# Altium schematic sheet Quarter to Full Bridge Strain Gauge Amplifier.SchDoc
size A4
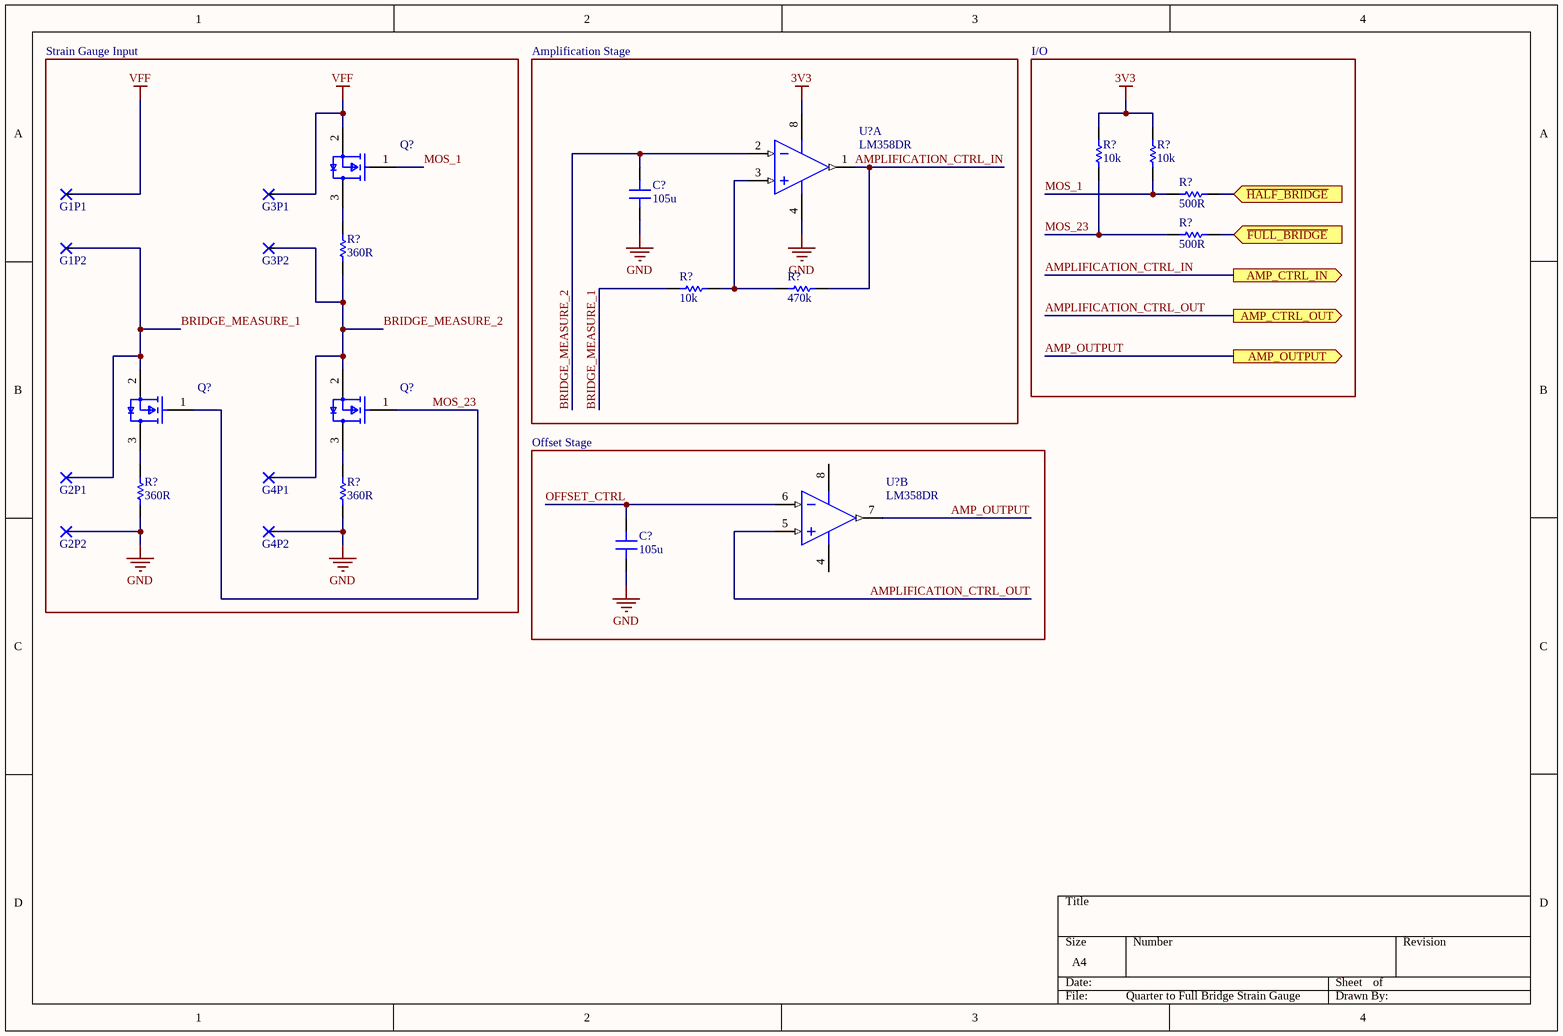
[diagram p0: Quarter to Full Bridge Strain Gauge Amplifier.SchDoc]

## Parts
(Parts that share a designator on the sheet are numbered #1, #2 ... from top to bottom, then left to right.)
C?#1  105u  [0805]
C?#2  105u  [0805]
G1P1  Rectangular  [2.5x5mm]  (value not drawn)
G1P2  Rectangular  [2.5x5mm]  (value not drawn)
G2P1  Rectangular  [2.5x5mm]  (value not drawn)
G2P2  Rectangular  [2.5x5mm]  (value not drawn)
G3P1  Rectangular  [2.5x5mm]  (value not drawn)
G3P2  Rectangular  [2.5x5mm]  (value not drawn)
G4P1  Rectangular  [2.5x5mm]  (value not drawn)
G4P2  Rectangular  [2.5x5mm]  (value not drawn)
Q?#1  (no value)  [FP-S-03946-MFG]
Q?#2  (no value)  [FP-S-03946-MFG]
Q?#3  (no value)  [FP-S-03946-MFG]
R?#1  10k  [0805]
R?#2  10k  [0805]
R?#3  500R  [0805]
R?#4  500R  [0805]
R?#5  360R  [0805]
R?#6  10k  [0805]
R?#7  470k  [0805]
R?#8  360R  [0805]
R?#9  360R  [0805]
U?#1  LM358DR  [D0008A_L]  (part A of 2)
U?#2  LM358DR  [D0008A_L]  (part B of 2)

## Blocks framed on the sheet
Strain Gauge Input: G1P1 G1P2 G2P1 G2P2 G3P1 G3P2 G4P1 G4P2 Q?#1-Q?#3 R?#5 R?#8 R?#9
Amplification Stage: C?#1 R?#6 R?#7 U?#1
I/O: R?#1-R?#4
Offset Stage: C?#2 U?#2

## Ports
AMP_CTRL_IN (out), AMP_CTRL_OUT (out), AMP_OUTPUT (out), ~{FULL_BRIDGE} (in), ~{HALF_BRIDGE} (in)

## Nets
3V3: R?#1.2 R?#2.2 U?#1.8(VCC)
GND: C?#1.1 C?#2.1 G2P2.1 G4P2.1 R?#8.2 R?#9.2 U?#1.4(GND)
VFF: G1P1.1 G3P1.1 Q?#1.2(S)
AMP_OUTPUT: U?#2.7(2OUT) ; port AMP_OUTPUT
AMPLIFICATION_CTRL_IN: R?#7.2 U?#1.1(1OUT) ; port AMP_CTRL_IN
AMPLIFICATION_CTRL_OUT: U?#2.5(2IN+) ; port AMP_CTRL_OUT
BRIDGE_MEASURE_1: G1P2.1 G2P1.1 Q?#2.2(S) R?#6.1
BRIDGE_MEASURE_2: C?#1.2 G3P2.1 G4P1.1 Q?#3.2(S) R?#5.2 U?#1.2(1IN-)
~{FULL_BRIDGE}: R?#4.2 ; port ~{FULL_BRIDGE}
~{HALF_BRIDGE}: R?#3.2 ; port ~{HALF_BRIDGE}
MOS_1: Q?#1.1(G) R?#2.1 R?#3.1
MOS_23: Q?#2.1(G) Q?#3.1(G) R?#1.1 R?#4.1
OFFSET_CTRL: C?#2.2 U?#2.6(2IN-)
NetQ?#1_3: Q?#1.3(D) R?#5.1
NetQ?#2_3: Q?#2.3(D) R?#8.1
NetQ?#3_3: Q?#3.3(D) R?#9.1
NetR?#6_2: R?#6.2 R?#7.1 U?#1.3(1IN+)

Not connected (* = marked no-connect by the designer): U?#2 4(GND) 8(VCC)

## Library data of the parts
C?#1 C?#2 = Capacitor - Ceramic: Value: 105u
Q?#1-Q?#3 = CMP-02550-000018-1: MOSFET N-CH 8V 6A SOT-23; Manufacturer Part Number: SI2342DS-T1-GE3; Manufacturer: Vishay; Number Of N Channels: 1; Pulse Drain Current: 30A; Reverse Recovery Charge: 17nC; Depletion Mode: False; Reverse Recovery Time: 40ns; Max Junction Temp: +150°C; Power Dissipation: 1.3W; Transconductance: 75S; Threshold Vgs Min: 0.35V; Turn Off Delay Time: 65ns; Rthja Max: 75°C/W; Input Capacitace At Vds: 1070pF @ 4V; Gate Charge At Vgs: 10.5nC @ 4.5V; Gate To Source Voltage: 5V; Turn On Delay Time: 6ns; Drain To Source Resistance: 0.014Ω; Typ Forward Diode Voltage: 0.82V; Standoff Height: 0.01mm; Max Forward Diode Voltage: 1.2V; Threshold Vgs Max: 0.8V; Max Power Dissipation: 2.5W; Gate to Source Voltage (Vgs): 4.5V; Polarity: N-CHANNEL; Rise Time: 14ns; Fall Time: 25ns; Rds On Max: 17mR; Threshold Voltage: 800mV; Input Capacitance: 1.07nF; Continuous Drain Current: 6A; Device Class L1: Discrete Semiconductors; Mouser Description: MOSFET 8V 6A 2.5; Category: Trans; Digikey Description: MOSFET N-CH 8V 6A SOT-23; Device Class L2: Transistors; Octopart: https://octopart.com/si2342ds-t1-ge3-vishay-45050957; ComponentLink2URL: https://www.vishay.com/docs/63302/si2342ds.pdf; RoHS: TRUE; Drain To Source Breakdown Voltage: 8V; Height: 1.12mm; Lead Free: Yes; Temperature Range Low: -55°C; Package: S-03946; Device Class L3: MOSFETs; Temperature Range High: +150°C; Ipc Land Pattern Name: SOT95P237X100-3; Drain To Source Voltage: 8V; Temperature: -55°C to +150°C; ComponentLink2Description: Datasheet; Number Of Channels: 1; Automotive: No; Supplier 1: LCSC; Supplier Part Number 1: C142553; Stock 1: 1853; Pricing 1: 1=0.54970, 10=0.40750, 30=0.38390, 100=0.35780, 500=0.34590, 1000=0.33880, 1=0.53450, 10=0.39620, 30=0.37330, 100=0.34780, 500=0.33630, 1000=0.32940, 1=2.70270, 10=2.00380, 30=1.88750, 100=1.75890, 500=1.70080, 1000=1.66590, 1=2.58390, 10=1.91570, 30=1.80450, 100=1.68160, 500=1.62600, 1000=1.59270, 1=0.34740, 10=0.25750, 30=0.24260, 100=0.22610, 500=0.21860, 1000=0.21410, 1=0.30590, 10=0.22680, 30=0.21370, 100=0.19910, 500=0.19250, 1000=0.18860, 1=3.24330, 10=2.40460, 30=2.26500, 100=2.11080, 500=2.04100, 1000=1.99910, 1=43.91150, 10=32.55580, 30=30.66670, 100=28.57820, 500=27.63360, 1000=27.06690, 1=1.69290, 10=1.25510, 30=1.18230, 100=1.10170, 500=1.06530, 1000=1.04350, 1=31.86130, 10=23.62180, 30=22.25110, 100=20.73570, 500=20.05040, 1000=19.63920, 1=3.51200, 10=2.60380, 30=2.45270, 100=2.28560, 500=2.21010, 1000=2.16480, 1=0.55710, 10=0.41300, 30=0.38900, 100=0.36250, 500=0.35060, 1000=0.34340, 1=0.41840, 10=0.31020, 30=0.29220, 100=0.27230, 500=0.26330, 1000=0.25790 (AUD); Mount: Surface Mount; Case/Package: SOT-23-3; Number of Pins: 3; Weight: 0.000282oz; Contact Plating: Tin,Matte; Min Operating Temperature: -55°C; Max Operating Temperature: 150°C; Packaging: Cut Tape; Package Quantity: 3000; Drain to Source Voltage (Vdss): 8V; Continuous Drain Current (ID): 6A; Series: SI2; Turn-Off Delay Time: 65ns; Turn-On Delay Time: 6ns; Number of Elements: 1; Radiation Hardening: No; RoHS Compliant: Yes; REACH SVHC: No SVHC; ComponentLink1URL: https://datasheet.ciiva.com/29746/si2342ds-29746581.pdf?src-supplier=Digi-Key; ComponentLink1Description: https://datasheet.ciiva.com/29746/si2342ds-29746581.pdf?src-supplier=Digi-Key; ComponentLink3URL: https://datasheet.ciiva.com/14905/si2342ds-14905257.pdf?src-supplier=Arrow+Electronics; ComponentLink3Description: https://datasheet.ciiva.com/14905/si2342ds-14905257.pdf?src-supplier=Arrow+Electronics; ComponentLink4URL: https://datasheet.ciiva.com/30021/si2342ds-30021814.pdf?src-supplier=Avnet; ComponentLink4Description: https://datasheet.ciiva.com/30021/si2342ds-30021814.pdf?src-supplier=Avnet; Supplier 2: Digi-Key; Supplier Part Number 2: SI2342DS-T1-GE3CT-ND; Stock 2: 22419; Pricing 2: 1=0.51000, 10=0.43600, 25=0.40800, 100=0.30320, 500=0.23670, 1000=0.19239 (USD)
R?#1-R?#9 = Resistor
  R?#1 R?#2 R?#6: Value: 10k
  R?#3 R?#4: Value: 500R
  R?#5 R?#8 R?#9: Value: 360R
  R?#7: Value: 470k
U?#1 U?#2 = CMP-1685-00009-1: Dual Operational Amplifier, 3 to 32 V, 0 to 70 degC, 8-Pin SOIC (D), Green (RoHS & no Sb/Br), Tape and Reel; Manufacturer: Texas Instruments; Gain Bandwidth Product: 700kHz; Common Mode Rejection Ratio: 65dB; Min Supply Voltage: 3V; Max Dual Supply Voltage: 16V; Voltage Gain: 100dB; Max Supply Voltage: 32V; Min Dual Supply Voltage: 1.5V; Number of Channels: 2; Nominal Supply Current: 1.2mA; Slew Rate: 0.3V/µs; Input Offset Voltage (Vos): 7mV; Input Bias Current: 250nA; Output Current: 30mA; Operating Supply Current: 1mA; Dual Supply Voltage: 9V; DatasheetVersion: SLOS068T, 04/2015; ComponentLink1URL: http://www.ti.com/; ComponentLink2URL: http://www.ti.com/lit/ds/symlink/lm358.pdf; ComponentLink3Description: Package Specification; Code_JEDEC: MS-012; PackageDescription: 8-Pin Small Outline Integrated Circuit, Body 4.9 x 3.9 mm, Pitch 1.27 mm; ComponentLink2Description: Datasheet; PackageVersion: 4040047-3/M, 06/2011; ComponentLink1Description: Manufacturer URL; ComponentLink3URL: http://www.ti.com/lit/ml/msoi002j/msoi002j.pdf; PackageReference: D0008A; Supplier 1: LCSC; Supplier Part Number 1: C5423; Manufacturer Part Number: LM358DR; RoHS: Yes; Category: Amplifiers - Op Amps, Buffer, Instrumentation; Stock 1: 7990; Pricing 1: 5=0.15780, 50=0.11970, 150=0.11270, 500=0.10580, 2500=0.10270, 5000=0.10110, 5=0.15420, 50=0.11700, 150=0.11020, 500=0.10340, 2500=0.10030, 5000=0.09880, 5=0.78630, 50=0.59640, 150=0.56190, 500=0.52730, 2500=0.51160, 5000=0.50380, 5=0.72970, 50=0.55350, 150=0.52140, 500=0.48930, 2500=0.47470, 5000=0.46750, 5=0.09810, 50=0.07440, 150=0.07010, 500=0.06580, 2500=0.06380, 5000=0.06280, 5=0.08900, 50=0.06750, 150=0.06360, 500=0.05970, 2500=0.05790, 5000=0.05700, 5=0.93420, 50=0.70860, 150=0.66750, 500=0.62640, 2500=0.60780, 5000=0.59850, 5=12.45670, 50=9.44850, 150=8.90060, 500=8.35270, 2500=8.10460, 5000=7.98060, 5=0.48680, 50=0.36920, 150=0.34780, 500=0.32640, 2500=0.31670, 5000=0.31180, 5=8.87080, 50=6.72860, 150=6.33840, 500=5.94830, 2500=5.77160, 5000=5.68320, 5=0.98590, 50=0.74780, 150=0.70440, 500=0.66110, 2500=0.64140, 5000=0.63160, 5=0.15970, 50=0.12110, 150=0.11410, 500=0.10710, 2500=0.10390, 5000=0.10230, 5=0.12050, 50=0.09140, 150=0.08610, 500=0.08080, 2500=0.07840, 5000=0.07720 (AUD); Mount: Surface Mount; Case/Package: SOIC; Number of Pins: 8; Contact Plating: Gold; Min Operating Temperature: 0°C; Max Operating Temperature: 70°C; Packaging: Tape and Reel; Number of Circuits: 2; Operating Supply Voltage: 16V; Package Quantity: 2500; Bandwidth: 700kHz; Output Current per Channel: 30mA; Number of Elements: 2; Unity Gain Bandwidth Product: 700kHz; Number of Amplifiers: 2; Power Supply Rejection Ratio (PSRR): 65dB; Length: 4.9mm; Width: 3.91mm; Height: 1.58mm; Radiation Hardening: No; Lead Free: Lead Free; REACH SVHC: No SVHC; ComponentLink4URL: https://datasheet.ciiva.com/1795/lm358-1795488.pdf?src-supplier=Digi-Key; ComponentLink4Description: https://datasheet.ciiva.com/1795/lm358-1795488.pdf?src-supplier=Digi-Key; ComponentLink5URL: https://datasheet.ciiva.com/27056/2016330-27056228.pdf?src-supplier=Jameco; ComponentLink5Description: https://datasheet.ciiva.com/27056/2016330-27056228.pdf?src-supplier=Jameco; ComponentLink6URL: https://datasheet.ciiva.com/26847/lm358dr-26847142.pdf?src-supplier=IIIC; ComponentLink6Description: https://datasheet.ciiva.com/26847/lm358dr-26847142.pdf?src-supplier=IIIC; ComponentLink7URL: https://datasheet.ciiva.com/1795/lm358-1795489.pdf?src-supplier=Digi-Key; ComponentLink7Description: https://datasheet.ciiva.com/1795/lm358-1795489.pdf?src-supplier=Digi-Key; ComponentLink8URL: https://datasheet.ciiva.com/46385/1874566-46385851.pdf?src-supplier=Element14; ComponentLink8Description: https://datasheet.ciiva.com/46385/1874566-46385851.pdf?src-supplier=Element14; ComponentLink9URL: https://datasheet.ciiva.com/46390/1874566-46390414.pdf?src-supplier=Element14; ComponentLink9Description: https://datasheet.ciiva.com/46390/1874566-46390414.pdf?src-supplier=Element14; ComponentLink10URL: https://datasheet.ciiva.com/1795/lm358-1795487.pdf?src-supplier=Digi-Key; ComponentLink10Description: https://datasheet.ciiva.com/1795/lm358-1795487.pdf?src-supplier=Digi-Key; ComponentLink11URL: https://datasheet.ciiva.com/2973/lm358a-2973386.pdf?src-supplier=Avnet; ComponentLink11Description: https://datasheet.ciiva.com/2973/lm358a-2973386.pdf?src-supplier=Avnet; ComponentLink12URL: https://datasheet.ciiva.com/7709/1874566-7709823.pdf?src-supplier=Element14; ComponentLink12Description: https://datasheet.ciiva.com/7709/1874566-7709823.pdf?src-supplier=Element14; Supplier 2: Digi-Key; Supplier Part Number 2: 296-1014-1-ND; Stock 2: 53204; Pricing 2: 1=0.40000, 10=0.29900, 25=0.26960, 100=0.14700, 250=0.14212, 500=0.12740, 1000=0.09800 (USD)